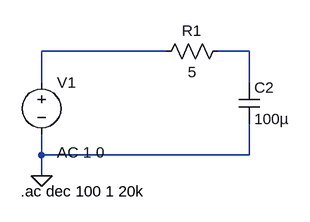
[diagram p0: schematic rc-filter-for-power-supply.asc]
rc-filter-for-power-supply.asc, the LTspice schematic file:
Version 4
SHEET 1 880 680
WIRE 208 64 16 64
WIRE 336 64 288 64
WIRE 16 112 16 64
WIRE 336 112 336 64
WIRE 16 224 16 192
WIRE 336 224 336 176
WIRE 336 224 16 224
WIRE 16 256 16 224
FLAG 16 256 0
SYMBOL voltage 16 96 R0
WINDOW 123 24 124 Left 2
WINDOW 39 0 0 Left 0
SYMATTR Value2 AC 1 0
SYMATTR InstName V1
SYMATTR Value ""
SYMBOL cap 320 112 R0
SYMATTR InstName C2
SYMATTR Value 100µ
SYMATTR SpiceLine Rser=27m
SYMBOL res 304 48 R90
WINDOW 0 0 56 VBottom 2
WINDOW 3 32 56 VTop 2
SYMATTR InstName R1
SYMATTR Value 5
TEXT -16 280 Left 2 !.ac dec 100 1 20k

The netlist it stands for:
* rc-filter-for-power-supply.asc
V1 N001 0 AC 1 0
C2 N002 0 100µ Rser=27m
R1 N002 N001 5
.ac dec 100 1 20k
.backanno
.end